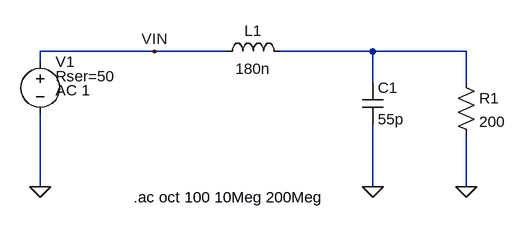
[diagram p0: schematic Lmatch100MHz.asc]
Lmatch100MHz.asc, the LTspice schematic file:
Version 4
SHEET 1 880 680
WIRE 208 304 32 304
WIRE 320 304 208 304
WIRE 544 304 400 304
WIRE 688 304 544 304
WIRE 32 320 32 304
WIRE 544 352 544 304
WIRE 688 352 688 304
WIRE 32 512 32 400
WIRE 544 512 544 416
WIRE 688 512 688 432
FLAG 688 512 0
FLAG 544 512 0
FLAG 32 512 0
FLAG 208 304 VIN
SYMBOL voltage 32 304 R0
WINDOW 3 24 96 Invisible 2
WINDOW 123 24 60 Left 2
WINDOW 39 24 38 Left 2
SYMATTR InstName V1
SYMATTR Value ""
SYMATTR Value2 AC 1
SYMATTR SpiceLine Rser=50
SYMBOL ind 304 320 R270
WINDOW 0 32 56 VTop 2
WINDOW 3 5 56 VBottom 2
SYMATTR InstName L1
SYMATTR Value 180n
SYMBOL cap 528 352 R0
SYMATTR InstName C1
SYMATTR Value 55p
SYMBOL res 672 336 R0
SYMATTR InstName R1
SYMATTR Value 200
TEXT 176 528 Left 2 !.ac oct 100 10Meg 200Meg

The netlist it stands for:
* Lmatch100MHz.asc
V1 VIN 0 AC 1 Rser=50
L1 VIN N001 180n
C1 N001 0 55p
R1 N001 0 200
.ac oct 100 10Meg 200Meg
.backanno
.end